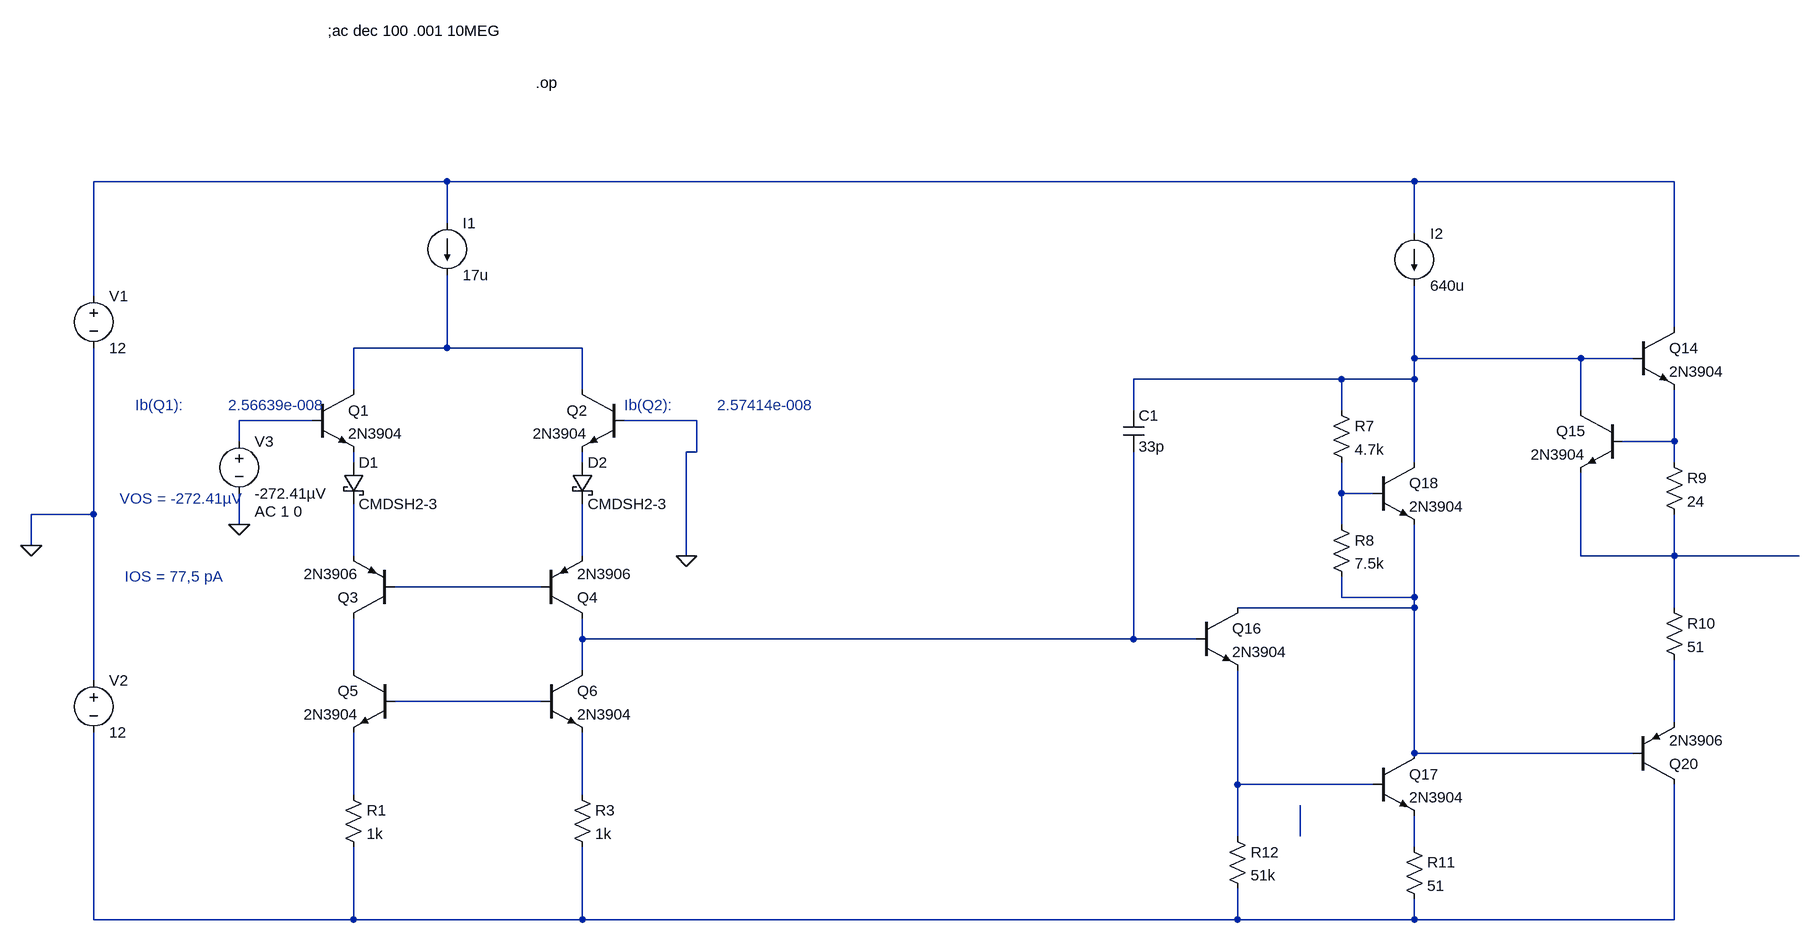
[diagram p0: schematic op_gen5.asc]
op_gen5.asc, the LTspice schematic file:
Version 4
SHEET 1 2276 1496
WIRE 144 -48 -400 -48
WIRE 1632 -48 144 -48
WIRE 2032 -48 1632 -48
WIRE 144 16 144 -48
WIRE 1632 32 1632 -48
WIRE -400 128 -400 -48
WIRE 2032 176 2032 -48
WIRE 144 208 144 96
WIRE 144 208 0 208
WIRE 352 208 144 208
WIRE 1632 224 1632 112
WIRE 1888 224 1632 224
WIRE 1968 224 1888 224
WIRE 1520 256 1200 256
WIRE 1632 256 1632 224
WIRE 1632 256 1520 256
WIRE 0 272 0 208
WIRE 352 272 352 208
WIRE 1200 304 1200 256
WIRE 1520 304 1520 256
WIRE 1888 304 1888 224
WIRE -64 320 -176 320
WIRE 528 320 416 320
WIRE -176 352 -176 320
WIRE 2032 352 2032 272
WIRE 2032 352 1952 352
WIRE 528 368 528 320
WIRE 528 368 512 368
WIRE 0 384 0 368
WIRE 352 384 352 368
WIRE 1632 384 1632 256
WIRE 2032 384 2032 352
WIRE 1520 432 1520 384
WIRE 1568 432 1520 432
WIRE -400 464 -400 208
WIRE -400 464 -496 464
WIRE -176 480 -176 432
WIRE 1520 480 1520 432
WIRE -496 512 -496 464
WIRE 0 528 0 448
WIRE 352 528 352 448
WIRE 512 528 512 368
WIRE 1888 528 1888 400
WIRE 2032 528 2032 464
WIRE 2032 528 1888 528
WIRE 2096 528 2032 528
WIRE 2224 528 2096 528
WIRE 288 576 64 576
WIRE 1520 592 1520 560
WIRE 1632 592 1632 480
WIRE 1632 592 1520 592
WIRE 1632 608 1632 592
WIRE 1632 608 1360 608
WIRE 2032 608 2032 528
WIRE 352 656 352 624
WIRE 1200 656 1200 368
WIRE 1200 656 352 656
WIRE 1296 656 1200 656
WIRE 0 704 0 624
WIRE 352 704 352 656
WIRE -400 720 -400 464
WIRE 288 752 64 752
WIRE 2032 784 2032 688
WIRE 1632 832 1632 608
WIRE 1968 832 1632 832
WIRE 1360 880 1360 704
WIRE 1568 880 1360 880
WIRE 0 896 0 800
WIRE 352 896 352 800
WIRE 1360 960 1360 880
WIRE 1456 960 1456 912
WIRE 1632 976 1632 928
WIRE -400 1088 -400 800
WIRE 0 1088 0 976
WIRE 0 1088 -400 1088
WIRE 352 1088 352 976
WIRE 352 1088 0 1088
WIRE 1360 1088 1360 1040
WIRE 1360 1088 352 1088
WIRE 1632 1088 1632 1056
WIRE 1632 1088 1360 1088
WIRE 2032 1088 2032 880
WIRE 2032 1088 1632 1088
FLAG -496 512 0
FLAG -176 480 0
FLAG 512 528 0
DATAFLAG 2096 528 ""
SYMBOL npn -64 272 R0
SYMATTR InstName Q1
SYMATTR Value 2N3904
SYMBOL schottky -16 384 R0
SYMATTR InstName D1
SYMATTR Value CMDSH2-3
SYMATTR Description Diode
SYMATTR Type diode
SYMBOL npn 416 272 M0
SYMATTR InstName Q2
SYMATTR Value 2N3904
SYMBOL schottky 336 384 R0
SYMATTR InstName D2
SYMATTR Value CMDSH2-3
SYMATTR Description Diode
SYMATTR Type diode
SYMBOL pnp 64 624 R180
SYMATTR InstName Q3
SYMATTR Value 2N3906
SYMBOL pnp 288 624 M180
SYMATTR InstName Q4
SYMATTR Value 2N3906
SYMBOL npn 64 704 M0
SYMATTR InstName Q5
SYMATTR Value 2N3904
SYMBOL npn 288 704 R0
SYMATTR InstName Q6
SYMATTR Value 2N3904
SYMBOL res -16 880 R0
SYMATTR InstName R1
SYMATTR Value 1k
SYMBOL res 336 880 R0
SYMATTR InstName R3
SYMATTR Value 1k
SYMBOL voltage -400 112 R0
WINDOW 123 0 0 Left 2
WINDOW 39 0 0 Left 2
SYMATTR InstName V1
SYMATTR Value 12
SYMBOL voltage -400 704 R0
WINDOW 123 0 0 Left 2
WINDOW 39 0 0 Left 2
SYMATTR InstName V2
SYMATTR Value 12
SYMBOL npn 1968 176 R0
SYMATTR InstName Q14
SYMATTR Value 2N3904
SYMBOL npn 1952 304 M0
SYMATTR InstName Q15
SYMATTR Value 2N3904
SYMBOL npn 1296 608 R0
SYMATTR InstName Q16
SYMATTR Value 2N3904
SYMBOL npn 1568 832 R0
SYMATTR InstName Q17
SYMATTR Value 2N3904
SYMBOL npn 1568 384 R0
SYMATTR InstName Q18
SYMATTR Value 2N3904
SYMBOL pnp 1968 880 M180
SYMATTR InstName Q20
SYMATTR Value 2N3906
SYMBOL res 1504 288 R0
SYMATTR InstName R7
SYMATTR Value 4.7k
SYMBOL res 1504 464 R0
SYMATTR InstName R8
SYMATTR Value 7.5k
SYMBOL res 2016 368 R0
SYMATTR InstName R9
SYMATTR Value 24
SYMBOL res 2016 592 R0
SYMATTR InstName R10
SYMATTR Value 51
SYMBOL res 1616 960 R0
SYMATTR InstName R11
SYMATTR Value 51
SYMBOL res 1344 944 R0
SYMATTR InstName R12
SYMATTR Value 51k
SYMBOL cap 1184 304 R0
SYMATTR InstName C1
SYMATTR Value 33p
SYMBOL voltage -176 336 R0
WINDOW 123 24 124 Left 2
WINDOW 39 0 0 Left 2
SYMATTR Value2 AC 1 0
SYMATTR InstName V3
SYMATTR Value -272.41µV
SYMBOL current 144 16 R0
WINDOW 123 0 0 Left 2
WINDOW 39 0 0 Left 2
SYMATTR InstName I1
SYMATTR Value 17u
SYMBOL current 1632 32 R0
WINDOW 123 0 0 Left 2
WINDOW 39 0 0 Left 2
SYMATTR InstName I2
SYMATTR Value 640u
TEXT 280 -200 Left 2 !.op
TEXT -336 296 Left 2 ;Ib(Q1):          2.56639e-008
TEXT 416 296 Left 2 ;Ib(Q2):          2.57414e-008
TEXT -352 560 Left 2 ;IOS = 77,5 pA
TEXT -360 440 Left 2 ;VOS = -272.41µV
TEXT -40 -280 Left 2 !;ac dec 100 .001 10MEG

The netlist it stands for:
* op_gen5.asc
Q1 N002 N004 N006 0 2N3904
D1 N006 N009 CMDSH2-3
Q2 N002 0 N007 0 2N3904
D2 N007 N010 CMDSH2-3
Q3 N015 N012 N009 0 2N3906
Q4 N014 N012 N010 0 2N3906
Q5 N015 N016 N019 0 2N3904
Q6 N014 N016 N020 0 2N3904
R1 N019 N023 1k
R3 N020 N023 1k
V1 N001 0 12
V2 0 N023 12
Q14 N001 N003 N005 0 2N3904
Q15 N003 N005 N011 0 2N3904
Q16 N013 N014 N018 0 2N3904
Q17 N013 N018 N022 0 2N3904
Q18 N003 N008 N013 0 2N3904
Q20 N023 N013 N017 0 2N3906
R7 N003 N008 4.7k
R8 N008 N013 7.5k
R9 N005 N011 24
R10 N011 N017 51
R11 N022 N023 51
R12 N018 N023 51k
C1 N003 N014 33p
V3 N004 0 -272.41µV AC 1 0
I1 N001 N002 17u
I2 N001 N003 640u
.model D D
.lib standard.dio
.model NPN NPN
.model PNP PNP
.lib standard.bjt
.op
* Ib(Q1):          2.56639e-008
* Ib(Q2):          2.57414e-008
* IOS = 77,5 pA
* VOS = -272.41µV
;ac dec 100 .001 10MEG
.backanno
.end